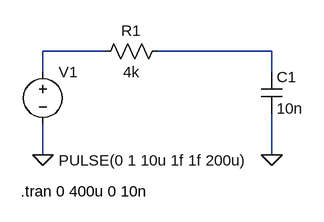
[diagram p0: schematic RC-цепь.asc]
RC-цепь.asc, the LTspice schematic file:
Version 4
SHEET 1 880 680
WIRE 0 16 -96 16
WIRE 256 16 80 16
WIRE -96 48 -96 16
WIRE 256 48 256 16
WIRE -96 176 -96 128
WIRE 256 176 256 112
FLAG -96 176 0
FLAG 256 176 0
SYMBOL cap 240 48 R0
SYMATTR InstName C1
SYMATTR Value 10n
SYMBOL voltage -96 32 R0
WINDOW 3 24 152 Left 2
WINDOW 123 0 0 Left 0
WINDOW 39 24 180 Left 2
SYMATTR InstName V1
SYMATTR Value PULSE(0 1 10u 1f 1f 200u)
SYMBOL res -16 32 R270
WINDOW 0 32 56 VTop 2
WINDOW 3 0 56 VBottom 2
SYMATTR InstName R1
SYMATTR Value 4k
TEXT -130 232 Left 2 !.tran 0 400u 0 10n

The netlist it stands for:
* RC-цепь.asc
C1 N002 0 10n
V1 N001 0 PULSE(0 1 10u 1f 1f 200u)
R1 N001 N002 4k
.tran 0 400u 0 10n
.backanno
.end